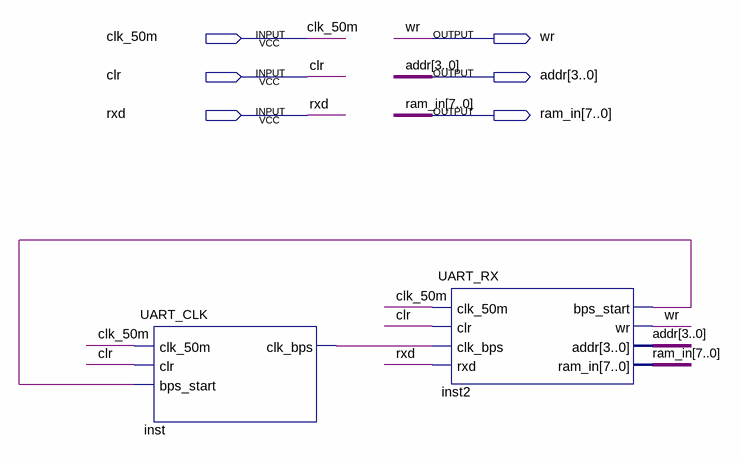
[diagram p0: schematic sheet]
// Quartus schematic input.bdf as structural Verilog: 2 symbols, 6 pins
module \input  (
  input  clk_50m,
  input  clr,
  input  rxd,
  output wr,
  output [3:0] addr,
  output [7:0] ram_in
);

  wire inst2_bps_start, inst_clk_bps;

  UART_CLK inst (.clk_50m(clk_50m), .clr(clr), .bps_start(inst2_bps_start), .clk_bps(inst_clk_bps));
  UART_RX inst2 (
    .clk_50m(clk_50m), .clr(clr), .clk_bps(inst_clk_bps), .rxd(rxd), .bps_start(inst2_bps_start), .wr(wr),
    .addr(addr), .ram_in(ram_in));
endmodule
